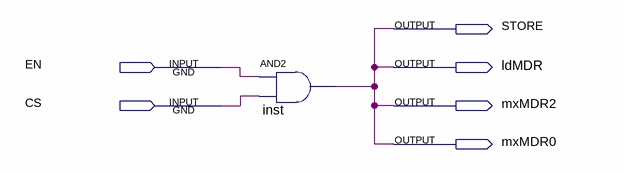
[diagram p0: schematic sheet]
// Quartus schematic STY.bdf as structural Verilog: 1 symbols, 6 pins
module STY (
  input  EN,
  input  CS,
  output STORE,
  output ldMDR,
  output mxMDR2,
  output mxMDR0
);

  and inst (ldMDR, EN, CS);

  assign mxMDR0 = ldMDR;
  assign mxMDR2 = ldMDR;
  assign STORE = ldMDR;
endmodule
